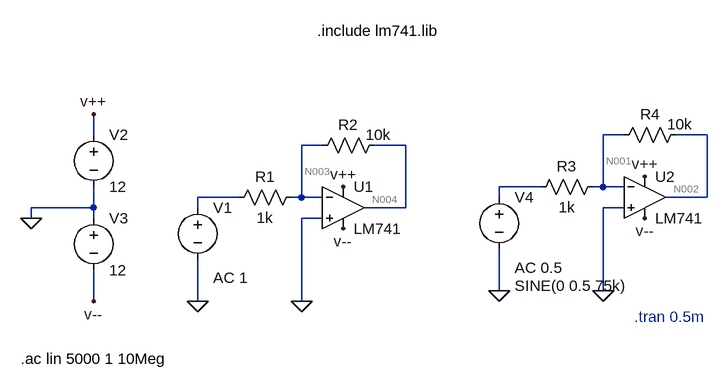
[diagram p0: schematic Simu punto A2.asc]
Simu punto A2.asc, the LTspice schematic file:
Version 4
SHEET 1 880 680
WIRE -288 80 -288 48
WIRE 528 80 496 80
WIRE 656 80 608 80
WIRE 64 96 32 96
WIRE 192 96 144 96
WIRE 400 160 336 160
WIRE 496 160 496 80
WIRE 496 160 480 160
WIRE 528 160 496 160
WIRE -64 176 -128 176
WIRE 32 176 32 96
WIRE 32 176 16 176
WIRE 64 176 32 176
WIRE 336 176 336 160
WIRE 656 176 656 80
WIRE 656 176 592 176
WIRE -288 192 -288 160
WIRE -288 192 -384 192
WIRE -128 192 -128 176
WIRE 192 192 192 96
WIRE 192 192 128 192
WIRE 528 192 496 192
WIRE -384 208 -384 192
WIRE -288 208 -288 192
WIRE 64 208 32 208
WIRE 336 320 336 256
WIRE 496 320 496 192
WIRE -288 336 -288 288
WIRE -128 336 -128 272
WIRE 32 336 32 208
FLAG 32 336 0
FLAG -128 336 0
FLAG -384 208 0
FLAG -288 48 v++
FLAG 96 160 v++
FLAG -288 336 v--
FLAG 96 224 v--
FLAG 496 320 0
FLAG 336 320 0
FLAG 560 144 v++
FLAG 560 208 v--
SYMBOL OpAmps\\opamp2 96 128 R0
SYMATTR InstName U1
SYMATTR Value LM741
SYMBOL res 32 160 R90
WINDOW 0 0 56 VBottom 2
WINDOW 3 32 56 VTop 2
SYMATTR InstName R1
SYMATTR Value 1k
SYMBOL res 160 80 R90
WINDOW 0 0 56 VBottom 2
WINDOW 3 -16 10 VTop 2
SYMATTR InstName R2
SYMATTR Value 10k
SYMBOL voltage -128 176 R0
WINDOW 123 24 124 Left 2
WINDOW 39 0 0 Left 0
SYMATTR Value2 AC 1
SYMATTR InstName V1
SYMATTR Value ""
SYMBOL voltage -288 64 R0
WINDOW 123 0 0 Left 0
WINDOW 39 0 0 Left 0
SYMATTR InstName V2
SYMATTR Value 12
SYMBOL voltage -288 192 R0
WINDOW 123 0 0 Left 0
WINDOW 39 0 0 Left 0
SYMATTR InstName V3
SYMATTR Value 12
SYMBOL OpAmps\\opamp2 560 112 R0
SYMATTR InstName U2
SYMATTR Value LM741
SYMBOL res 496 144 R90
WINDOW 0 0 56 VBottom 2
WINDOW 3 32 56 VTop 2
SYMATTR InstName R3
SYMATTR Value 1k
SYMBOL res 624 64 R90
WINDOW 0 0 56 VBottom 2
WINDOW 3 -16 10 VTop 2
SYMATTR InstName R4
SYMATTR Value 10k
SYMBOL voltage 336 160 R0
WINDOW 3 24 152 Left 2
WINDOW 123 24 124 Left 2
WINDOW 39 0 0 Left 0
SYMATTR Value SINE(0 0.5 75k)
SYMATTR Value2 AC 0.5
SYMATTR InstName V4
TEXT 56 -80 Left 2 !.include lm741.lib
TEXT -400 424 Left 2 !.ac lin 5000 1 10Meg
TEXT 544 360 Left 2 ;.tran 0.5m

The netlist it stands for:
* Simu punto A2.asc
XU1 0 N003 v++ v-- N004 LM741  ; pins In+ In- V+ V- OUT
R1 N003 N006 1k
R2 N004 N003 10k
V1 N006 0 AC 1
V2 v++ 0 12
V3 0 v-- 12
XU2 0 N001 v++ v-- N002 LM741  ; pins In+ In- V+ V- OUT
R3 N001 N005 1k
R4 N002 N001 10k
V4 N005 0 SINE(0 0.5 75k) AC 0.5
.include lm741.lib
.ac lin 5000 1 10Meg
* .tran 0.5m
.backanno
.end

* Results of the author's LTspice run, read from the files saved beside the schematic
* Operating Point, zero values left out:
*   V(n003) = 1 mV
*   V(v--) = -12 V
*   V(v++) = 12 V
*   V(n004) = 12.02 mV
*   V(n001) = 1 mV
*   V(n002) = 12.02 mV
*   I(R1) = 1 µA
*   I(R2) = 1.102 µA
*   I(R3) = 1 µA
*   I(R4) = 1.102 µA
*   I(V1) = 1 µA
*   I(V2) = -3.253 mA
*   I(V3) = -3.251 mA
*   I(V4) = 1 µA
*   Ix(u1:1) = 57.86 nA
*   Ix(u1:2) = 101.9 nA
*   Ix(u1:99) = 1.627 mA
*   Ix(u1:50) = -1.626 mA
*   Ix(u1:28) = -1.102 µA
*   Ix(u2:1) = 57.86 nA
*   Ix(u2:2) = 101.9 nA
*   Ix(u2:99) = 1.627 mA
*   Ix(u2:50) = -1.626 mA
*   Ix(u2:28) = -1.102 µA
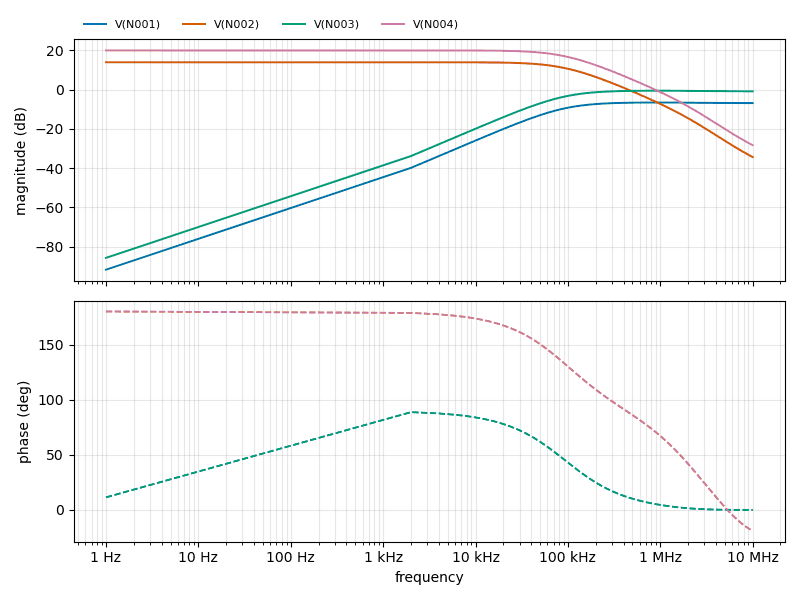
[diagram p1: AC Analysis of Simu punto A2.asc, plotted from the saved traces]
* AC Analysis, 1 run:
*   V(N001): -91.72 dB at 1 Hz, -6.84 dB at 10 MHz, peak -6.56 dB at 932.2 kHz, 3 dB below the peak at 91.39 kHz
*   V(N002): 13.98 dB at 1 Hz, -34.32 dB at 10 MHz, peak 13.98 dB at 1 Hz, 3 dB below the peak at 93.2 kHz
*   V(N003): -85.70 dB at 1 Hz, -0.82 dB at 10 MHz, peak -0.54 dB at 932.2 kHz, 3 dB below the peak at 91.39 kHz
*   V(N004): 20.00 dB at 1 Hz, -28.30 dB at 10 MHz, peak 20.00 dB at 1 Hz, 3 dB below the peak at 93.2 kHz